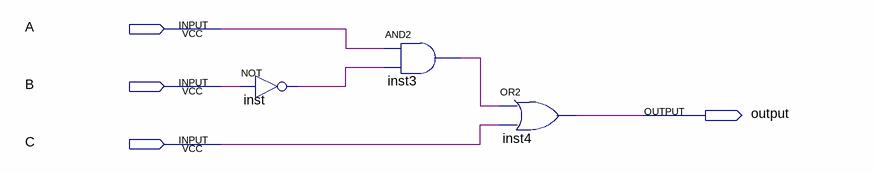
[diagram p0: schematic sheet]
// Quartus schematic AmaiorB.bdf as structural Verilog: 3 symbols, 4 pins
module AmaiorB (
  input  A,
  input  B,
  input  C,
  output \output 
);

  wire inst3_out, inst_out;

  not inst (inst_out, B);
  and inst3 (inst3_out, A, inst_out);
  or inst4 (\output , inst3_out, C);
endmodule
